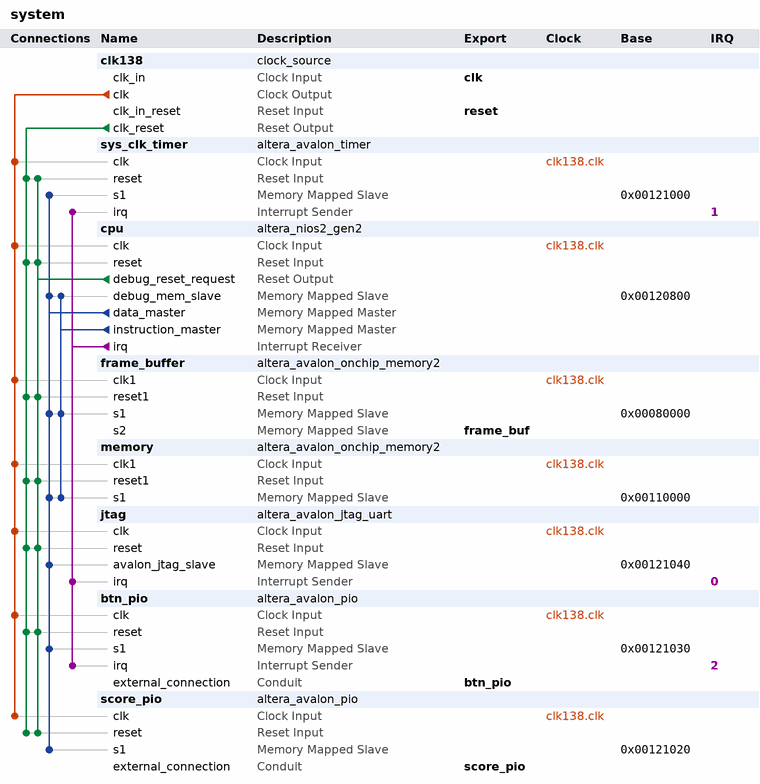
[diagram p0: system contents]
# Platform Designer (Qsys) system system, Cyclone V 5CSEMA5F31C6
# Parameters at their usual value, and those the tool derives, are not listed.
package require -exact qsys 21.1
create_system system
set_project_property DEVICE_FAMILY {Cyclone V}
set_project_property DEVICE 5CSEMA5F31C6

add_instance clk138 clock_source 21.1
set_instance_parameter_value clk138 clockFrequency 138000000

add_instance sys_clk_timer altera_avalon_timer 21.1
set_instance_parameter_value sys_clk_timer period 1
set_instance_parameter_value sys_clk_timer periodUnits MSEC

add_instance cpu altera_nios2_gen2 21.1
set_instance_parameter_value cpu dcache_size 2048
set_instance_parameter_value cpu exceptionSlave memory.s1
set_instance_parameter_value cpu icache_size 4096
set_instance_parameter_value cpu impl Tiny
set_instance_parameter_value cpu resetSlave memory.s1

add_instance frame_buffer altera_avalon_onchip_memory2 21.1
set_instance_parameter_value frame_buffer dataWidth 32
set_instance_parameter_value frame_buffer dualPort true
set_instance_parameter_value frame_buffer initMemContent true
set_instance_parameter_value frame_buffer initializationFileName /home/martb/Desktop/ram.hex
set_instance_parameter_value frame_buffer instanceID FRAM
set_instance_parameter_value frame_buffer memorySize 282144
set_instance_parameter_value frame_buffer readDuringWriteMode OLD_DATA
set_instance_parameter_value frame_buffer singleClockOperation true

add_instance memory altera_avalon_onchip_memory2 21.1
set_instance_parameter_value memory dataWidth 32
set_instance_parameter_value memory dualPort false
set_instance_parameter_value memory initMemContent true
set_instance_parameter_value memory initializationFileName /home/martb/Desktop/ram.hex
set_instance_parameter_value memory memorySize 65536
set_instance_parameter_value memory singleClockOperation true

add_instance jtag altera_avalon_jtag_uart 21.1
set_instance_parameter_value jtag simInteractiveOptions NO_INTERACTIVE_WINDOWS

add_instance btn_pio altera_avalon_pio 21.1
set_instance_parameter_value btn_pio captureEdge true
set_instance_parameter_value btn_pio direction Input
set_instance_parameter_value btn_pio edgeType FALLING
set_instance_parameter_value btn_pio generateIRQ true
set_instance_parameter_value btn_pio irqType EDGE
set_instance_parameter_value btn_pio simDoTestBenchWiring true
set_instance_parameter_value btn_pio simDrivenValue 1
set_instance_parameter_value btn_pio width 4

add_instance score_pio altera_avalon_pio 21.1
set_instance_parameter_value score_pio direction Output
set_instance_parameter_value score_pio width 6

# connections
add_connection clk138.clk btn_pio.clk clock
add_connection clk138.clk cpu.clk clock
add_connection clk138.clk frame_buffer.clk1 clock
add_connection clk138.clk jtag.clk clock
add_connection clk138.clk memory.clk1 clock
add_connection clk138.clk score_pio.clk clock
add_connection clk138.clk sys_clk_timer.clk clock
add_connection clk138.clk_reset btn_pio.reset reset
add_connection clk138.clk_reset cpu.reset reset
add_connection clk138.clk_reset frame_buffer.reset1 reset
add_connection clk138.clk_reset jtag.reset reset
add_connection clk138.clk_reset memory.reset1 reset
add_connection clk138.clk_reset score_pio.reset reset
add_connection clk138.clk_reset sys_clk_timer.reset reset
add_connection cpu.debug_reset_request btn_pio.reset reset
add_connection cpu.debug_reset_request cpu.reset reset
add_connection cpu.debug_reset_request frame_buffer.reset1 reset
add_connection cpu.debug_reset_request jtag.reset reset
add_connection cpu.debug_reset_request memory.reset1 reset
add_connection cpu.debug_reset_request score_pio.reset reset
add_connection cpu.debug_reset_request sys_clk_timer.reset reset
add_connection cpu.data_master btn_pio.s1 avalon
set_connection_parameter_value cpu.data_master/btn_pio.s1 baseAddress 0x00121030
add_connection cpu.data_master cpu.debug_mem_slave avalon
set_connection_parameter_value cpu.data_master/cpu.debug_mem_slave baseAddress 0x00120800
add_connection cpu.data_master frame_buffer.s1 avalon
set_connection_parameter_value cpu.data_master/frame_buffer.s1 baseAddress 0x00080000
add_connection cpu.data_master jtag.avalon_jtag_slave avalon
set_connection_parameter_value cpu.data_master/jtag.avalon_jtag_slave baseAddress 0x00121040
add_connection cpu.data_master memory.s1 avalon
set_connection_parameter_value cpu.data_master/memory.s1 baseAddress 0x00110000
add_connection cpu.data_master score_pio.s1 avalon
set_connection_parameter_value cpu.data_master/score_pio.s1 baseAddress 0x00121020
add_connection cpu.data_master sys_clk_timer.s1 avalon
set_connection_parameter_value cpu.data_master/sys_clk_timer.s1 baseAddress 0x00121000
add_connection cpu.instruction_master cpu.debug_mem_slave avalon
set_connection_parameter_value cpu.instruction_master/cpu.debug_mem_slave baseAddress 0x00120800
add_connection cpu.instruction_master frame_buffer.s1 avalon
set_connection_parameter_value cpu.instruction_master/frame_buffer.s1 baseAddress 0x00080000
add_connection cpu.instruction_master memory.s1 avalon
set_connection_parameter_value cpu.instruction_master/memory.s1 baseAddress 0x00110000
add_connection cpu.irq btn_pio.irq interrupt
set_connection_parameter_value cpu.irq/btn_pio.irq irqNumber 2
add_connection cpu.irq jtag.irq interrupt
set_connection_parameter_value cpu.irq/jtag.irq irqNumber 0
add_connection cpu.irq sys_clk_timer.irq interrupt
set_connection_parameter_value cpu.irq/sys_clk_timer.irq irqNumber 1

# exported interfaces
add_interface btn_pio conduit end
set_interface_property btn_pio EXPORT_OF btn_pio.external_connection
add_interface clk clock sink
set_interface_property clk EXPORT_OF clk138.clk_in
add_interface frame_buf avalon slave
set_interface_property frame_buf EXPORT_OF frame_buffer.s2
add_interface reset reset sink
set_interface_property reset EXPORT_OF clk138.clk_in_reset
add_interface score_pio conduit end
set_interface_property score_pio EXPORT_OF score_pio.external_connection

set_interconnect_requirement {$system} qsys_mm.clockCrossingAdapter HANDSHAKE
set_interconnect_requirement {$system} qsys_mm.enableEccProtection FALSE
set_interconnect_requirement {$system} qsys_mm.insertDefaultSlave FALSE
set_interconnect_requirement {$system} qsys_mm.maxAdditionalLatency 1

save_system system.qsys
